# Altium schematic sheet CONNECTORS.SchDoc
size A4; SheetNumber: 1; SheetTotal: 5
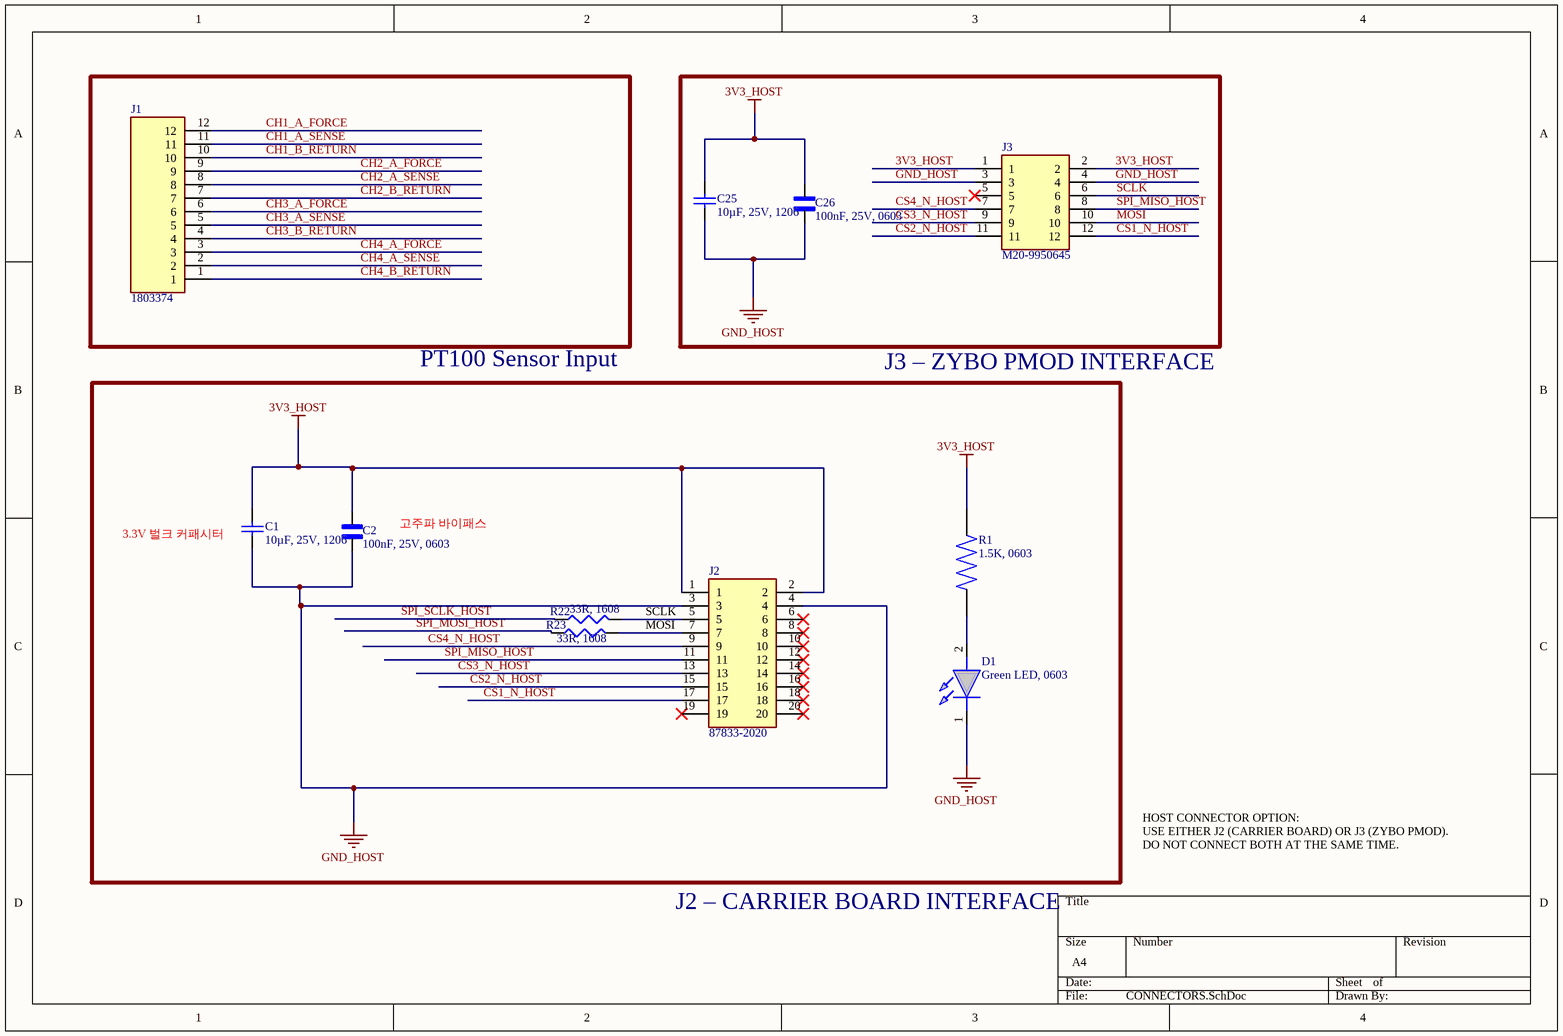
[diagram p0: CONNECTORS.SchDoc]

## Parts
C1  10µF, 25V, 1206  [C1206]
C2  100nF, 25V, 0603  [CAPC1608X90N]
C25  10µF, 25V, 1206  [C1206]
C26  100nF, 25V, 0603  [CAPC1608X90N]
D1  Green LED, 0603  [LEDC1608X75N]
J1  1803374  [1803374]
J2  87833-2020  [SHDRRA20W55P200_2X10_2265X640X630P]
J3  M20-9950645  [HDRRA12W66P254_2X6_1524X254X508P]
R1  1.5K, 0603  [RESC1607X60N]
R22  33R, 1608  [J1-0603]
R23  33R, 1608  [J1-0603]

## Nets
3V3_HOST: C1.2 C2.2 C25.2 C26.2 J2.1 J2.2 J3.1 J3.2 R1.1
GND_HOST: C1.1 C2.1 C25.1 C26.1 D1.1(K) J2.3 J2.4 J3.3 J3.4
CH1_A_FORCE: J1.12
CH1_A_SENSE: J1.11
CH1_B_RETURN: J1.10
CH2_A_FORCE: J1.9
CH2_A_SENSE: J1.8
CH2_B_RETURN: J1.7
CH3_A_FORCE: J1.6
CH3_A_SENSE: J1.5
CH3_B_RETURN: J1.4
CH4_A_FORCE: J1.3
CH4_A_SENSE: J1.2
CH4_B_RETURN: J1.1
CS1_N_HOST: J2.17 J3.12
CS2_N_HOST: J2.15 J3.11
CS3_N_HOST: J2.13 J3.9
CS4_N_HOST: J2.9 J3.7
MOSI: J2.7 J3.10 R23.2
SCLK: J2.5 J3.6 R22.2
SPI_MISO_HOST: J2.11 J3.8
SPI_MOSI_HOST: R23.1
SPI_SCLK_HOST: R22.1
NetD1_2: D1.2(A) R1.2

Not connected (* = marked no-connect by the designer): J2 6* 8* 10* 12* 14* 16* 18* 19* 20*; J3 5*

## Notes on the sheet
- PT100 Sensor Input
- J3 – ZYBO PMOD INTERFACE
- (near C1) 3.3V 벌크 커패시터
- (near C2) 고주파 바이패스
- HOST CONNECTOR OPTION:
  USE EITHER J2 (CARRIER BOARD) OR J3 (ZYBO PMOD).
  DO NOT CONNECT BOTH AT THE SAME TIME.
- J2 – CARRIER BOARD INTERFACE

## Library data of the parts
C1 C25 = Cap Semi: 10µF, 25V, X7R, ±5%, 1206 / C1206C106J3RACTU; Value: 10uF; Published: 8-Jun-2000; LatestRevisionDate: 29-May-2009; LatestRevisionNote: IPC-7351 Footprint Added.; PackageReference: C1206; Publisher: Altium Limited; PackageDescription: Chip Capacitor
C2 C26 = CL10B104KA8VPJC: Multilayer Ceramic Capacitors MLCC - SMD/SMT; MF: Samsung Electro-Mechanics; SnapEDA_Link: https://www.snapeda.com/parts/CL10B104KA8VPJC/Samsung/view-part/?ref=snap; Package: SMD-2 Samsung; Value: *; MP: CL10B104KA8VPJC; Check_prices: https://www.snapeda.com/parts/CL10B104KA8VPJC/Samsung/view-part/?ref=eda
D1 = KPH-1608SGC: Green Chip LED 1.6x0.8mm Kingbright KPH-1608SGC, 603 Series Green LED, 568 nm 1608 (0603), Rectangle Lens SMD package; Geometry.Height: 0.75mm; element14 Part Number: *; element14 Price/Stock: *; Manufacturer_Name: Kingbright; Manufacturer_Part_Number: KPH-1608SGC; Datasheet Link: https://kingbright-europe.de/_daten/2013-2015KBE-P005-023-SMD-LED.pdf
J1 = 1803374: MC 1,5/12-G-3,81 - PCB headers, nominal cross section: 1.5 mm<sup>2</sup>, color: green, nominal current: 8 A, rated voltage (III/2): 160 V, contact surface: Sn, contact connection type: Pin, number of potentials: 12, number of rows: 1, number of positions: 12, number of connections: 12, product range: MC 1,5/..-G, pitch: 3.81 mm, screw head form: L Slotted, mounting: Wave soldering, pin layout: Linear pinning, solder pin [P]: 3.4 mm, number of solder pins per potential: 1, plug-in system: COMBICON MC 1,5,; Manufacturer_Name: Phoenix Contact; Geometry.Height: 8.25mm; Manufacturer_Part_Number: 1803374; Mouser Part Number: 651-1803374; Mouser Price/Stock: https://www.mouser.co.uk/ProductDetail/Phoenix-Contact/1803374?qs=%2FbRkJSLTVS9mX%2FTOf8pTQA%3D%3D; Arrow Part Number: 1803374; Arrow Price/Stock: https://www.arrow.com/en/products/1803374/phoenix-contact?utm_currency=USD&region=nac; Datasheet Link: https://www.phoenixcontact.com/en-us/products/pcb-header-mc-1512-g-381-1803374?type=pdf
J2 = 87833-2020: Milli-Grid 2.0mm Header rightangle 20way Molex 87833 Series, 2mm Pitch 20 Way 2 Row Right Angle PCB Header, Solder Termination, 2A; Geometry.Height: 6.3mm; Mouser Part Number: 538-87833-2020; Mouser Price/Stock: https://www.mouser.co.uk/ProductDetail/Molex/87833-2020?qs=9Wl4wMk6NjqIn8s9c3rdaw%3D%3D; Manufacturer_Name: Molex; Manufacturer_Part_Number: 87833-2020; Datasheet Link: https://www.molex.com/pdm_docs/sd/878332020_sd.pdf
J3 = M20-9950645: M20: 6+6 Pos Plug DIL Right-Angle 3mm THT Connector 6.1mm pin Gold; Manufacturer_Name: Harwin; Geometry.Height: 5.08mm; Mouser Part Number: 855-M20-9950645; Mouser Price/Stock: https://www.mouser.co.uk/ProductDetail/Harwin/M20-9950645?qs=WS5Jv%252B%252Bx1qVrnrdlGO%252BcnA%3D%3D; Manufacturer_Part_Number: M20-9950645; Datasheet Link: https://content.harwin.com/m/2bbbbcb217f49919/original/DRG-00474-Technical-Drawing-Datasheet-M20-995-pdf.pdf
R1 = RC0603FR-071K5L: 1.5 kOhms Â±1% 0.1W, 1/10W Chip Resistor 0603 (1608 Metric) Moisture Resistant Thick Film; MF: Yageo; SnapEDA_Link: https://www.snapeda.com/parts/RC0603FR-071K5L/Yageo/view-part/?ref=snap; Package: 0603 Yageo; Value: *; MP: RC0603FR-071K5L; Check_prices: https://www.snapeda.com/parts/RC0603FR-071K5L/Yageo/view-part/?ref=eda
R22 R23 = Res3: Resistor; Published: 8-Jun-2000; LatestRevisionDate: 29-May-2009; LatestRevisionNote: IPC-7351 Footprint Added.; PackageReference: J1-0603; Publisher: Altium Limited; PackageDescription: Chip Resistor; Value: 33R